# Altium schematic sheet BlockDiagram.SchDoc
size A3; SheetNumber: 2; SheetTotal: 6
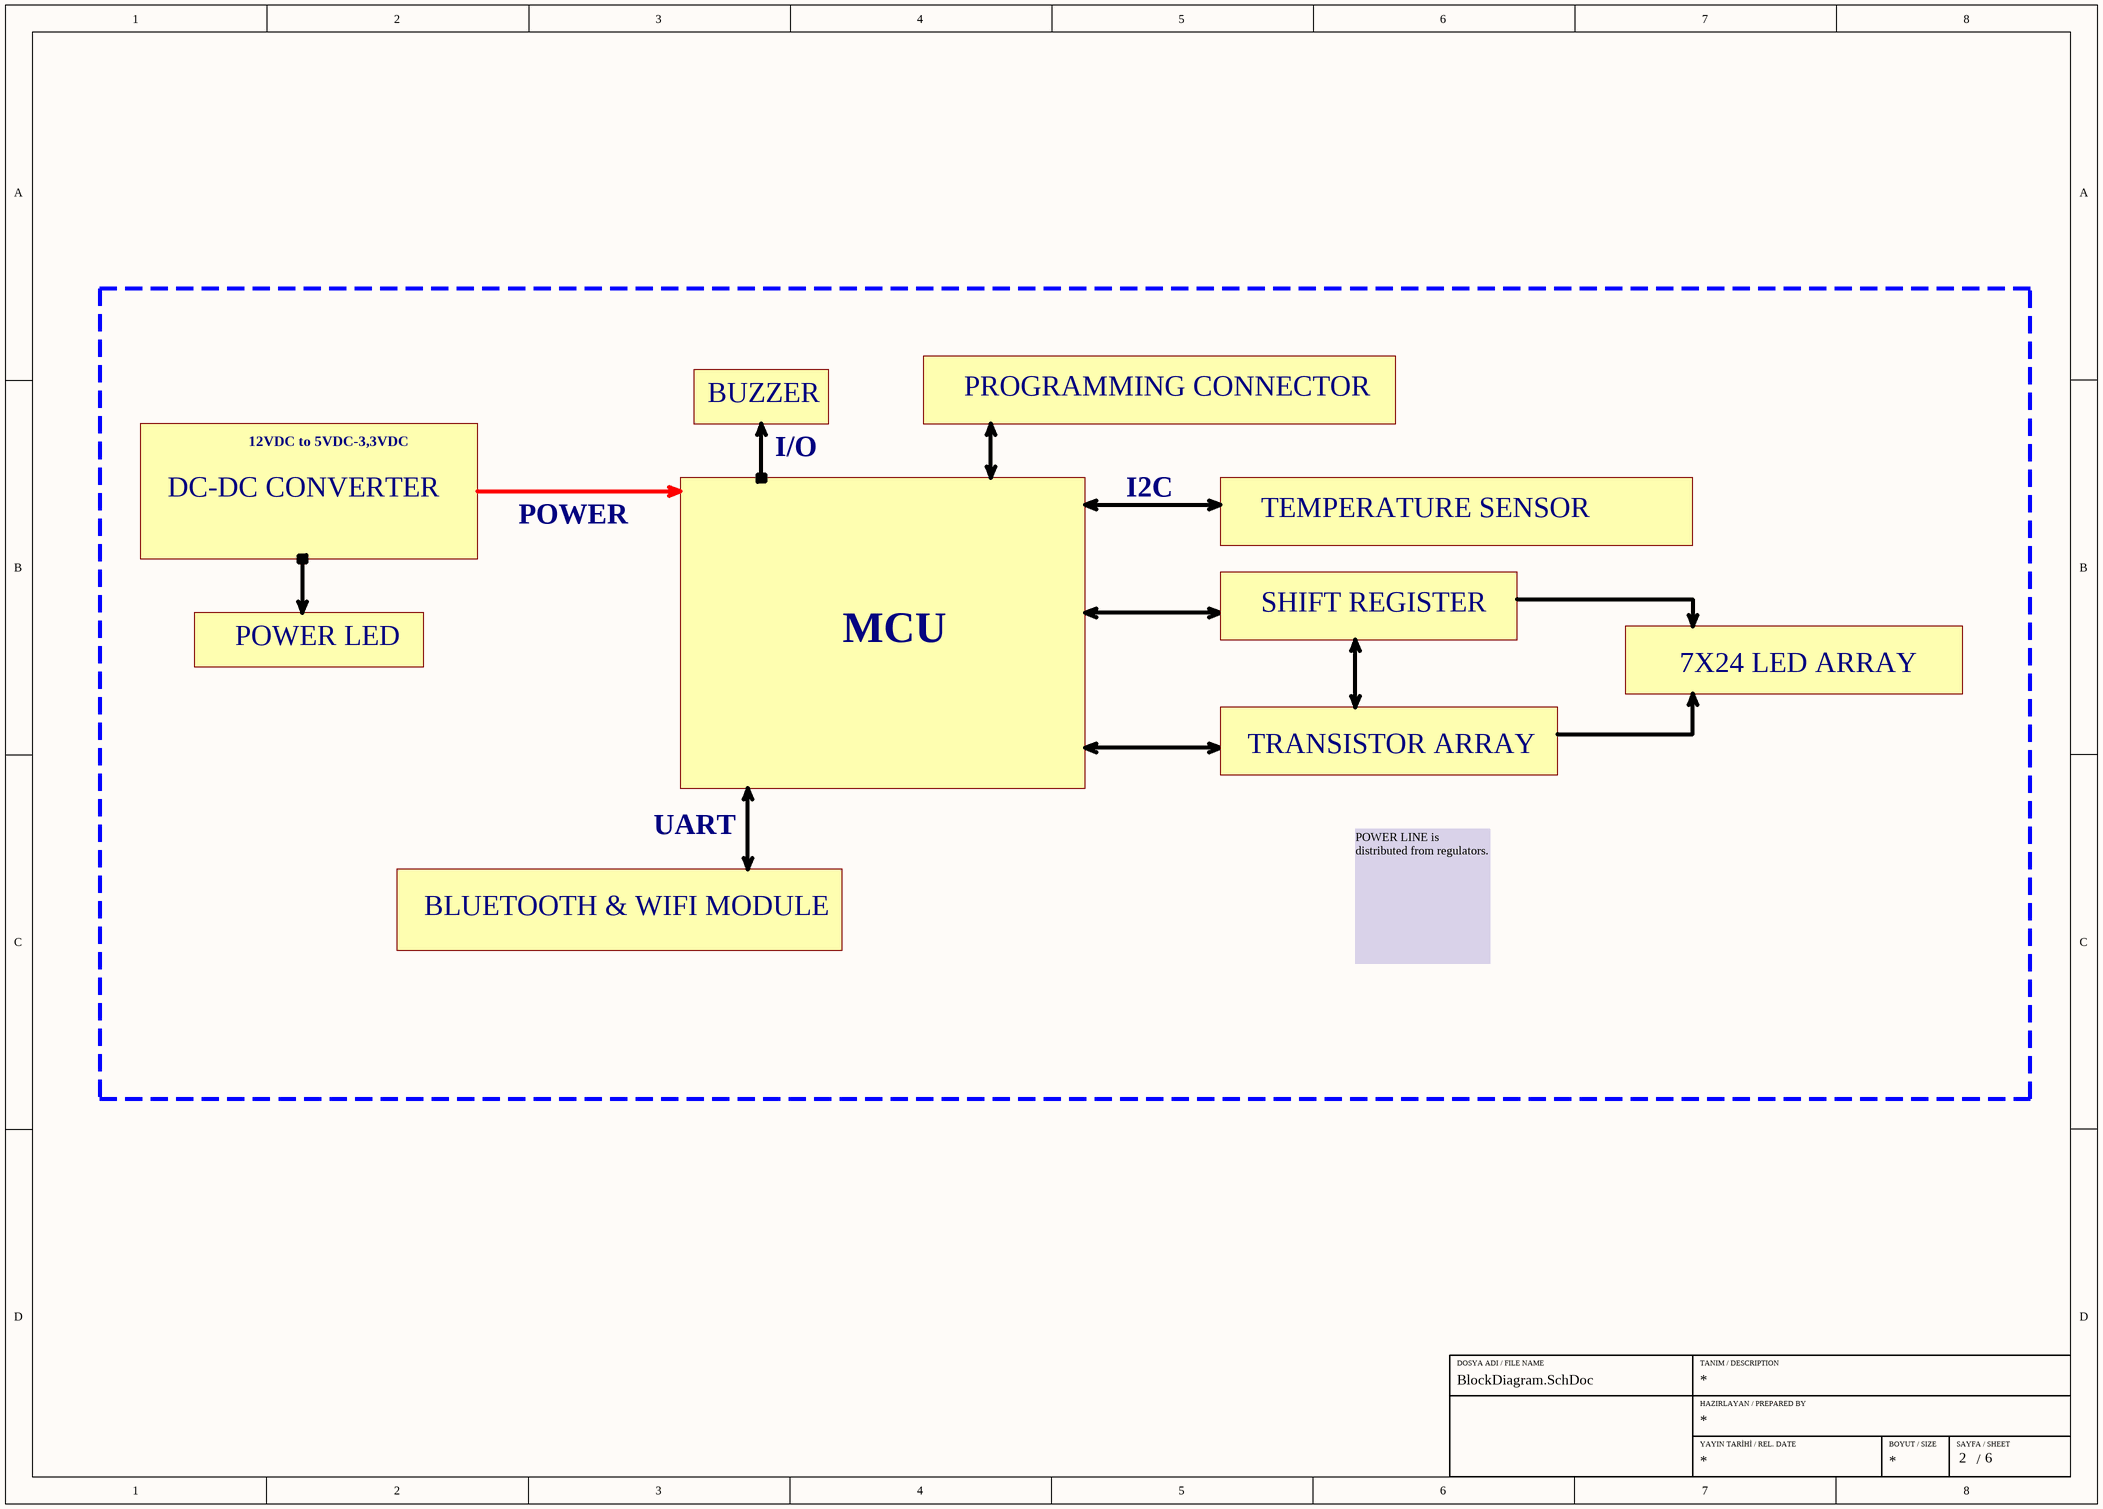
[diagram p0: BlockDiagram.SchDoc]

## Notes on the sheet
- 12VDC to 5VDC-3,3VDC
- BUZZER
- PROGRAMMING CONNECTOR
- DC-DC CONVERTER
- I/O
- I2C
- POWER
- TEMPERATURE SENSOR
- POWER LED
- MCU
- SHIFT REGISTER
- 7X24 LED ARRAY
- TRANSISTOR ARRAY
- UART
- BLUETOOTH & WIFI MODULE
- POWER LINE is distributed from regulators.
- DOSYA ADI / FILE NAME
- TANIM / DESCRIPTION
- HAZIRLAYAN / PREPARED BY
- YAYIN TARİHİ / REL. DATE
- BOYUT / SIZE
- SAYFA / SHEET
- /